# Altium schematic sheet Sheet1.SchDoc
size A4
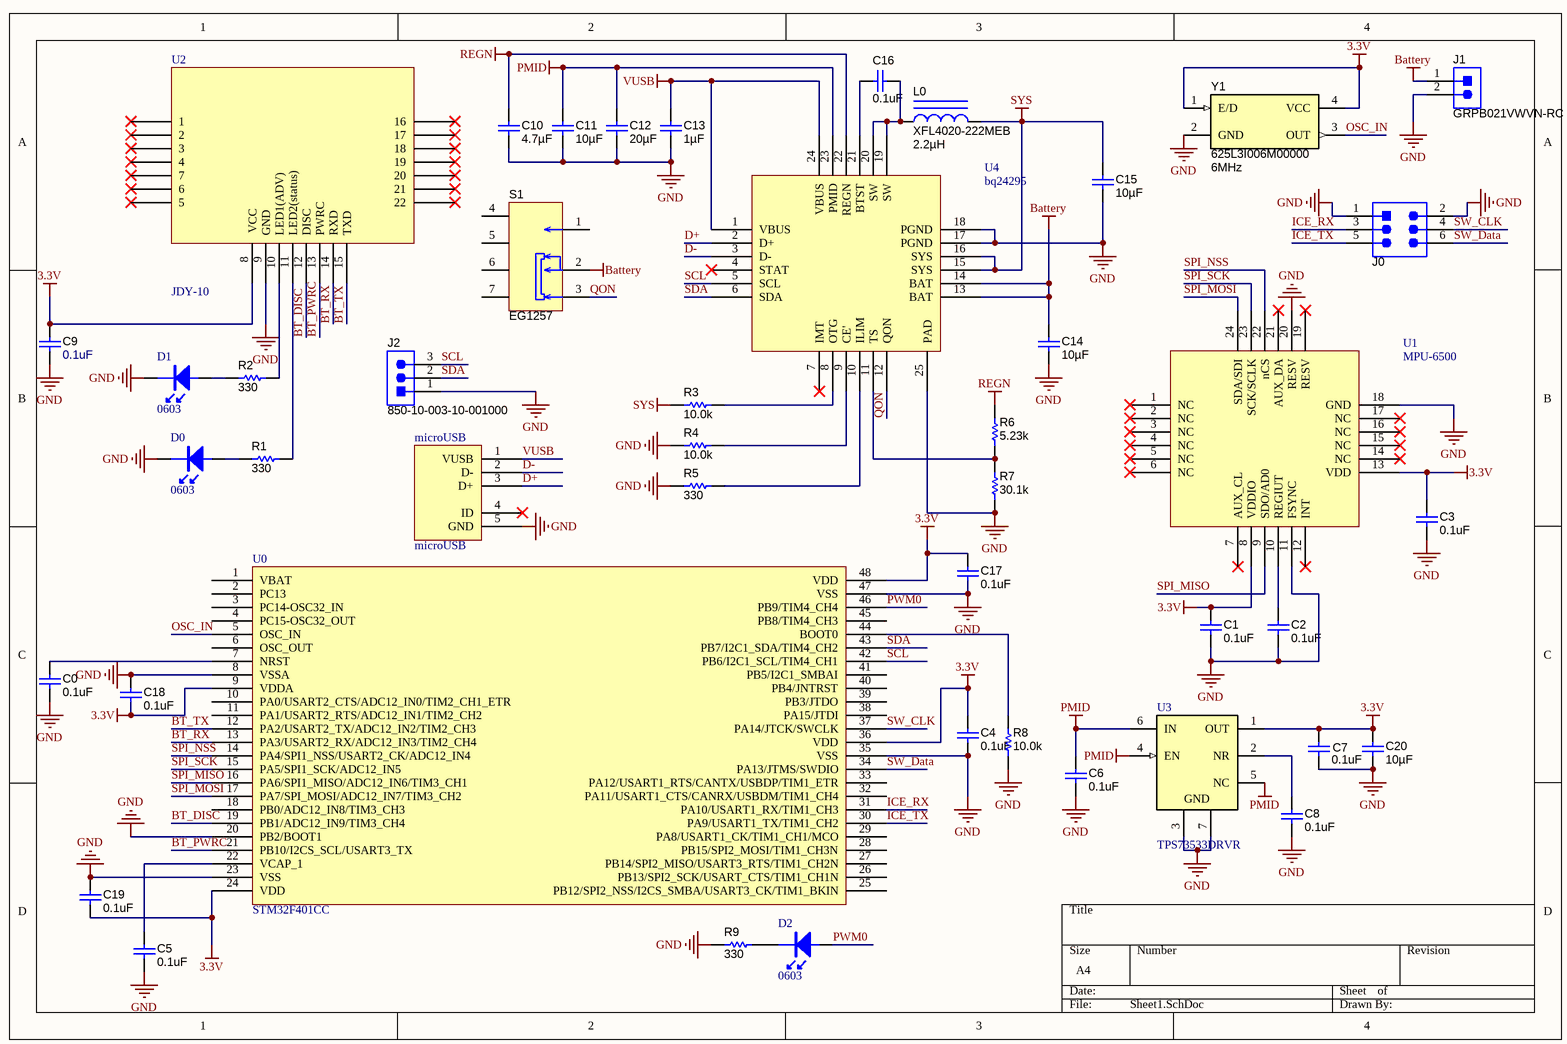
[diagram p0: Sheet1.SchDoc]

## Parts
C0  ValueDisplayed: 0.1uF  [0402S]  (hidden comment: 0402YC132KAT2A)
C1  ValueDisplayed: 0.1uF  [0402S]  (hidden comment: 0402YC132KAT2A)
C2  ValueDisplayed: 0.1uF  [0402S]  (hidden comment: 0402YC132KAT2A)
C3  ValueDisplayed: 0.1uF  [0402S]  (hidden comment: 0402YC132KAT2A)
C4  ValueDisplayed: 0.1uF  [0402S]  (hidden comment: 0402YC132KAT2A)
C5  ValueDisplayed: 0.1uF  [0402S]  (hidden comment: 0402YC132KAT2A)
C6  ValueDisplayed: 0.1uF  [0402S]  (hidden comment: 0402YC132KAT2A)
C7  ValueDisplayed: 0.1uF  [0402S]  (hidden comment: 0402YC132KAT2A)
C8  ValueDisplayed: 0.1uF  [0402S]  (hidden comment: 0402YC132KAT2A)
C9  ValueDisplayed: 0.1uF  [0402S]  (hidden comment: 0402YC132KAT2A)
C10  ValueDisplayed: 4.7µF  [0603L]  (hidden comment: VJ1206Y473KXEAT5Z)
C11  ValueDisplayed: 10µF  [0805L]  (hidden comment: VJ1206Y473KXEAT5Z)
C12  ValueDisplayed: 20µF  [0805L]  (hidden comment: VJ1206Y473KXEAT5Z)
C13  ValueDisplayed: 1µF  [0402S]  (hidden comment: 0402YC132KAT2A)
C14  ValueDisplayed: 10µF  [0805L]  (hidden comment: VJ1206Y473KXEAT5Z)
C15  ValueDisplayed: 10µF  [0805L]  (hidden comment: VJ1206Y473KXEAT5Z)
C16  ValueDisplayed: 0.1uF  [0402S]  (hidden comment: 0402YC132KAT2A)
C17  ValueDisplayed: 0.1uF  [0402S]  (hidden comment: 0402YC132KAT2A)
C18  ValueDisplayed: 0.1uF  [0402S]  (hidden comment: 0402YC132KAT2A)
C19  ValueDisplayed: 0.1uF  [0402S]  (hidden comment: 0402YC132KAT2A)
C20  ValueDisplayed: 10µF  [0805L]  (hidden comment: VJ1206Y473KXEAT5Z)
D0  0603  [LED_0603]
D1  0603  [LED_0603]
D2  0603  [LED_0603]
J0  GRPB032VWVN-RC  [Sullins_GRPB032VWVN-RC]  (value not drawn)
J1  GRPB021VWVN-RC  [Sullins_GRPB021VWVN-RC]
J2  850-10-003-10-001000  [Mill-Max_850-10-003-10-001000]
L0  XFL4020-222MEB  ValueDisplayed: 2.2µH  [XFL4020]
microUSB  microUSB  [Micro_USB]
R1  ValueDisplayed: 330  [0402S]  (hidden comment: PCF0402-12-10KBT1)
R2  ValueDisplayed: 330  [0402S]  (hidden comment: PCF0402-12-10KBT1)
R3  ValueDisplayed: 10.0k  [0402S]  (hidden comment: PCF0402-12-10KBT1)
R4  ValueDisplayed: 10.0k  [0402S]  (hidden comment: PCF0402-12-10KBT1)
R5  ValueDisplayed: 330  [0402S]  (hidden comment: PCF0402-12-10KBT1)
R6  ValueDisplayed: 5.23k  [0402S]  (hidden comment: PCF0402-12-10KBT1)
R7  ValueDisplayed: 30.1k  [0402S]  (hidden comment: PCF0402-12-10KBT1)
R8  ValueDisplayed: 10.0k  [0402S]  (hidden comment: PCF0402-12-10KBT1)
R9  ValueDisplayed: 330  [0402S]  (hidden comment: PCF0402-12-10KBT1)
S1  EG1257  [SW_EG1257]
U0  STM32F401CC  [RSL0048B_NV]
U1  MPU-6500  [QFN24 (3x3x0.9)]
U2  JDY-10  [PCBComponent_1]
U3  TPS73533DRVR  [DRV0006A]
U4  bq24295  [RGE0024H_NV]
Y1  625L3I006M00000  Frequency: 6MHz  [OSC_CTS_625]

## Nets
3.3V: C1.1 C3.1 C4.1 C7.1 C9.1 C17.1 C18.2 C19.2 C20.1 U0.9(VDDA) U0.24(VDD) U0.36(VDD) U0.48(VDD) U1.8(VDDIO) U1.13(VDD) U2.8(VCC) U3.1(OUT) Y1.1(E/D) Y1.4(VCC)
Battery: C14.1 J1.1 S1.2 U4.13(BAT) U4.14(BAT)
GND: C0.2 C1.2 C2.2 C3.2 C4.2 C5.2 C6.2 C7.2 C8.2 C9.2 C10.2 C11.2 C12.2 C13.2 C14.2 C15.2 C17.2 C18.1 C19.1 C20.2 D0.2 D1.2 J0.1 J0.2 J1.2 J2.1 microUSB.5(GND) R4.1 R5.1 R7.1 R8.1 R9.1 U0.8(VSSA) U0.20(PB2/BOOT1) U0.23(VSS) U0.35(VSS) U0.47(VSS) U1.11(FSYNC) U1.18(GND) U1.20(RESV) U2.9(GND) U3.3(GND) U3.7(GND) U4.17(PGND) U4.18(PGND) U4.25(PAD) Y1.2(GND)
PMID: C6.1 C11.1 C12.1 U3.4(EN) U3.5(NC) U3.6(IN) U4.23(PMID)
REGN: C10.1 R6.2 U4.22(REGN)
SYS: C15.1 L0.2 R3.1 U4.15(SYS) U4.16(SYS)
VUSB: C13.1 microUSB.1(VUSB) U4.1(VBUS) U4.24(VBUS)
BT_DISC: U0.19(PB1/ADC12_IN9/TIM3_CH4) U2.12(DISC)
BT_PWRC: U0.21(PB10/I2CS_SCL/USART3_TX) U2.13(PWRC)
BT_RX: U0.13(PA3/USART2_RX/ADC12_IN3/TIM2_CH4) U2.14(RXD)
BT_TX: U0.12(PA2/USART2_TX/ADC12_IN2/TIM2_CH3) U2.15(TXD)
D+: microUSB.3(D+) U4.2(D+)
D-: microUSB.2(D-) U4.3(D-)
ICE_RX: J0.3 U0.31(PA10/USART1_RX/TIM1_CH3)
ICE_TX: J0.5 U0.30(PA9/USART1_TX/TIM1_CH2)
OSC_IN: U0.5(OSC_IN) Y1.3(OUT)
PWM0: D2.1 U0.46(PB9/TIM4_CH4)
QON: S1.3 U4.12(QON)
SCL: J2.3 U0.42(PB6/I2C1_SCL/TIM4_CH1) U4.5(SCL)
SDA: J2.2 U0.43(PB7/I2C1_SDA/TIM4_CH2) U4.6(SDA)
SPI_MISO: U0.16(PA6/SPI1_MISO/ADC12_IN6/TIM3_CH1) U1.9(SDO/AD0)
SPI_MOSI: U0.17(PA7/SPI_MOSI/ADC12_IN7/TIM3_CH2) U1.24(SDA/SDI)
SPI_NSS: U0.14(PA4/SPI1_NSS/USART2_CK/ADC12_IN4) U1.22(nCS)
SPI_SCK: U0.15(PA5/SPI1_SCK/ADC12_IN5) U1.23(SCK/SCLK)
SW_CLK: J0.4 U0.37(PA14/JTCK/SWCLK)
SW_Data: J0.6 U0.34(PA13/JTMS/SWDIO)
NetC0_1: C0.1 U0.7(NRST)
NetC2_1: C2.1 U1.10(REGIUT)
NetC5_1: C5.1 U0.22(VCAP_1)
NetC8_1: C8.1 U3.2(NR)
NetC16_1: C16.1 L0.1 U4.19(SW) U4.20(SW)
NetC16_2: C16.2 U4.21(BTST)
NetD0_1: D0.1 R1.1
NetD1_1: D1.1 R2.1
NetD2_2: D2.2 R9.2
NetR1_2: R1.2 U2.11(LED2(status))
NetR2_2: R2.2 U2.10(LED1(ADV))
NetR3_2: R3.2 U4.8(OTG)
NetR4_2: R4.2 U4.9(CE')
NetR5_2: R5.2 U4.10(ILIM)
NetR6_1: R6.1 R7.2 U4.11(TS)
NetR8_2: R8.2 U0.44(BOOT0)

Not connected (* = marked no-connect by the designer): microUSB 4(ID)*; S1 1 4 5 6 7; U0 1(VBAT) 2(PC13) 3(PC14-OSC32_IN) 4(PC15-OSC32_OUT) 6(OSC_OUT) 10(PA0/USART2_CTS/ADC12_IN0/TIM2_CH1_ETR) 11(PA1/USART2_RTS/ADC12_IN1/TIM2_CH2) 18(PB0/ADC12_IN8/TIM3_CH3) 25(PB12/SPI2_NSS/I2CS_SMBA/USART3_CK/TIM1_BKIN) 26(PB13/SPI2_SCK/USART_CTS/TIM1_CH1N) 27(PB14/SPI2_MISO/USART3_RTS/TIM1_CH2N) 28(PB15/SPI2_MOSI/TIM1_CH3N) 29(PA8/USART1_CK/TIM1_CH1/MCO) 32(PA11/USART1_CTS/CANRX/USBDM/TIM1_CH4) 33(PA12/USART1_RTS/CANTX/USBDP/TIM1_ETR) 38(PA15/JTDI) 39(PB3/JTDO) 40(PB4/JNTRST) 41(PB5/I2C1_SMBAI) 45(PB8/TIM4_CH3); U1 1(NC)* 2(NC)* 3(NC)* 4(NC)* 5(NC)* 6(NC)* 7(AUX_CL)* 12(INT)* 14(NC)* 15(NC)* 16(NC)* 17(NC)* 19(RESV)* 21(AUX_DA)*; U2 1* 2* 3* 4* 5* 6* 7* 16* 17* 18* 19* 20* 21* 22*; U4 4(STAT)* 7(IMT)*

## Library data of the parts
C0-C9 C13 C16-C19 = 0402YC132KAT2A: CAP, CERM, 1300 pF, 16 V, +/- 10%, X7R, 0402; Manufacturer: AVX; Polarized: N; CompType: Capacitor; Value: 1300pF; U/M: EA; Cap_F: 0.0000000013; Tolerance_%: 10; Value1: Unknown; VDC_V: 16; Value2: 16V; TaMin_C: -55; TaMax_C: 125; Cap_Case: 0402; SymbolVersion: 2008-07-09; PartNumber: 0402YC132KAT2A; PackageReference: 0402; RoHS: Y; MountType: SMT; Technology: Ceramic; TempCo: X7R; Published: 2008-06-19; Publisher: Texas Instruments; LatestRevisionDate: 2015-07-02; ComponentLink1Description: Datasheet link; ComponentLink1URL: https://www.avx.com/docs/catalogs/cx7r.pdf; Supplier 1: Digi-Key; Supplier Part Number 1: 0402YC132KAT2A-ND
C10-C12 C14 C15 C20 = VJ1206Y473KXEAT5Z: CAP, CERM, 0.047 µF, 500 V, +/- 10%, X7R, 1206; Manufacturer: Vishay-Vitramon; Polarized: N; CompType: Capacitor; Value: 0.047uF; U/M: EA; Cap_F: 0.000000047; Tolerance_%: 10; Value1: Unknown; VDC_V: 500; Value2: 500V; TaMin_C: -55; TaMax_C: 125; Cap_Case: 1206; SymbolVersion: 2008-07-09; PartNumber: VJ1206Y473KXEAT5Z; PackageReference: 1206; RoHS: Y; MountType: SMT; Technology: Ceramic; TempCo: X7R; Published: 2008-06-19; Publisher: Texas Instruments; LatestRevisionDate: 2015-07-02; ComponentLink1Description: Datasheet link; ComponentLink1URL: http://www.vishay.com/docs/45199/commseri.pdf; Supplier 1: Digi-Key; Supplier Part Number 1: 720-1033-1-ND; Supplier 2: Mouser; Supplier Part Number 2: 77-VJ1206Y473KXEAT5Z; Supplier 3: Farnell; Supplier Part Number 3: 1961237
D0-D2 = LED_0603: Color: Green; Color: Blue
J0 = GRPB032VWVN-RC: Header, 50mil, 3x2, Gold, TH; Manufacturer: Sullins Connector Solutions; SymbolCreator: a0412235; U/M: EA; SymbolVersion: 2013-10-14; PartNumber: GRPB032VWVN-RC; ClassName: Header; PackageReference: Header, 3x2, 1.27mm, TH; CompType: Header; RoHS: Y; MountType: TH; ComponentLink1Description: Datasheet Link; ComponentLink1URL: http://www.sullinscorp.com/drawings/82_GRPB___2VWVN-RC,_10954-D.pdf; Publisher: Texas Instruments; LatestRevisionDate: 2014-11-22; Supplier 1: Digi-Key; Supplier Part Number 1: S9015E-03-ND
J1 = GRPB021VWVN-RC: Header, 50mil, 2x1, Gold, TH; Manufacturer: Sullins Connector Solutions; SymbolCreator: a0412235; U/M: EA; SymbolVersion: 2013-10-31; PartNumber: GRPB021VWVN-RC; ClassName: Header; PackageReference: 2x1 Header; CompType: Header; RoHS: Y; MountType: TH; ComponentLink1Description: Datasheet Link; ComponentLink1URL: http://www.sullinscorp.com/catalogs/71_Page70-71_HEADER_.050_1.27mm_MALE.pdf; Publisher: Texas Instruments; LatestRevisionDate: 2014-11-22; Supplier 1: Digi-Key; Supplier Part Number 1: S9014E-02-ND
J2 = 850-10-003-10-001000: Header, 50mil, 3x1, Gold, TH; Manufacturer: Mill-Max; SymbolCreator: a0799628; U/M: EA; SymbolVersion: 2013-03-28; PartNumber: 850-10-003-10-001000; ClassName: Header; PackageReference: Header, 1.27 mm, 3x1, Gold, Straight, TH; CompType: Header; RoHS: Y; MountType: TH; ComponentLink1Description: Datasheet Link; ComponentLink1URL: https://www.mill-max.com/assets/pdfs/metric/034M.PDF; Publisher: Texas Instruments; LatestRevisionDate: 2014-11-22; Supplier 1: Mouser; Supplier Part Number 1: 575-85013
L0 = XFL4020-222MEB: Inductor, Shielded, Composite, 2.2uH, 3.7A, 0.02 ohm, SMD; Manufacturer: Coilcraft; Ind_H: 2.2E-6; Imax_A: 3.7; Irms: 8A @ 40C rise; Isat: 3.7A @ 30% inductance drop; DCR_ohm: 0.02; U/M: EA; SymbolVersion: 2008-07-23; CompType: Inductor; Value: 2.2uH; PartNumber: XFL4020-222MEB; PackageReference: 4x2x4mm; Value1: 0.02 ohm; Value2: 3.7A; Technology: Shielded; MountType: SMT; Material: Composite; Published: 2008-06-26; Publisher: Texas Instruments; LatestRevisionDate: 2013-10-24; ComponentLink1Description: Datasheet link; ComponentLink1URL: http://www.coilcraft.com/pdfs/xfl4020.pdf; RoHS: Y; Supplier 1: Mouser; Supplier Part Number 1: 994-XFL4020-222MEB
R1-R9 = PCF0402-12-10KBT1: RES, 10.0 k, 0.1%, 0.063 W, 0402; Manufacturer: TT Electronics/IRC; CompType: Resistor; Value: 10.0k; Res_ohm: 10000; Value_Code: 10k0; Tolerance_%: 0.1; Power_W: 0.063; Value2: 0.063W; VDC_V: 25; TempCo: 10 ppm/C; EIA_Code: E192; U/M: EA; SymbolVersion: 2009-05-29; PartNumber: PCF0402-12-10KBT1; PackageReference: 0402; RoHS: Y; Value1: 0.1%; MountType: SMT; Technology: Thin Film; Published: 2008-06-26; Publisher: Texas Instruments; LatestRevisionDate: 2015-07-01; ComponentLink1Description: Datasheet link; ComponentLink1URL: http://www.welwyn-tt.com/pdf/datasheet/PCF.pdf; Supplier 1: Digi-Key; Supplier Part Number 1: 985-1366-1-ND
S1 = EG1257: Switch, Slide, SPDT, 0.3A, SMT; Manufacturer: E-Switch; SymbolCreator: a0411947; VDC_V: 4; SwitchFunction: On-On; PositionCount: 2; CurrentRating_mA: 300; SymbolVersion: 2013-11-20; PartNumber: EG1257; MountType: SMT; ComponentLink1Description: Datasheet URL; ComponentLink1URL: http://spec.e-switch.com/P-J/P112221E.pdf; RoHS: Y; Circuit: SPDT; Orientation: Side Actuated; CompType: Switch; PackageReference: 6.7x1.4x2.6mm; Publisher: Texas Instruments; LatestRevisionDate: 2015-02-03; Supplier 1: Digi-Key; Supplier Part Number 1: EG2586CT-ND; Supplier 2: Mouser; Supplier Part Number 2: 612-EG1257; Supplier 3: Newark; Supplier Part Number 3: 15N7308
U2 = Component_1
U3 = TPS73533DRVR: Single Output High PSRR LDO, 500 mA, Fixed 3.3 V Output, 2.7 to 6.5 V Input, with Low IQ, 6-pin SON (DRV), -40 to 125 degC, Green (RoHS & no Sb/Br); Manufacturer: Texas Instruments; Alternate PartNumber: Equivalent; Accuracy(%): 2; Fixed Output Options(V): 3.3; Iout(Max)(A): 0.5; Iq(Typ)(mA): 0.04; SubFamily: Single Channel LDO; Vdo(Typ)(mV): 280; Vin(Max)(V): 6.5; Vin(Min)(V): 2.7; DatasheetVersion: SBVS087J; PackageVersion: 4206925/E; PackageReference: DRV0006A; PackageDescription: 6-Pin Plastic Small Outline No-Lead, Body 2 x 2 mm, Pitch 0.65 mm; Supplier 1: Digi-Key; Supplier Part Number 1: TPS73533DRVR-ND; Supplier 2: Newark; Supplier Part Number 2: 09R6709; Supplier 3: Mouser; Supplier Part Number 3: 595-TPS73533DRVR; Eco-Plan: Green (RoHS & no Sb/Br); Vout Adj(Max)(V): 3.3; Vout Adj(Min)(V): 3.3; MountType: SMT; PartNumber: TPS73533DRVR; ComponentLink1Description: Manufacturer URL; ComponentLink1URL: http://www.ti.com/; ComponentLink2Description: Datasheet; ComponentLink2URL: http://www.ti.com/general/docs/lit/getliterature.tsp?genericPartNumber=TPS73533&fileType=pdf; ComponentLink3Description: Package Specification; ComponentLink3URL: http://www.ti.com/litv/pdf/mpds216d; Alternate Manufacturer: Texas Instruments
Y1 = 625L3I006M00000: Oscillator, 6MHz, 3.3V, SMD; Manufacturer: CTS Electrocomponents; SymbolCreator: a0411947; U/M: EA; TaMin_C: -40; TaMax_C: 85; Frequency Stability: ±50ppm; SymbolVersion: 2013-04-01; PartNumber: 625L3I006M00000; CompType: Oscillator; PackageReference: 2.5x1x2.5mm; MountType: SMT; RoHS: Y; ComponentLink1Description: Datasheet Link; ComponentLink1URL: http://www.ctscorp.com/components/Datasheets/008-0329-0_A.pdf; Publisher: Texas Instruments; LatestRevisionDate: 2015-06-26; Supplier 1: Digi-Key; Supplier Part Number 1: CTX974CT-ND; Supplier 2: Mouser; Supplier Part Number 2: 774-625L3I006M00000